# EAGLE design dice2_perf (EAGLE 9.0.1)

## Sheet 1 of 2
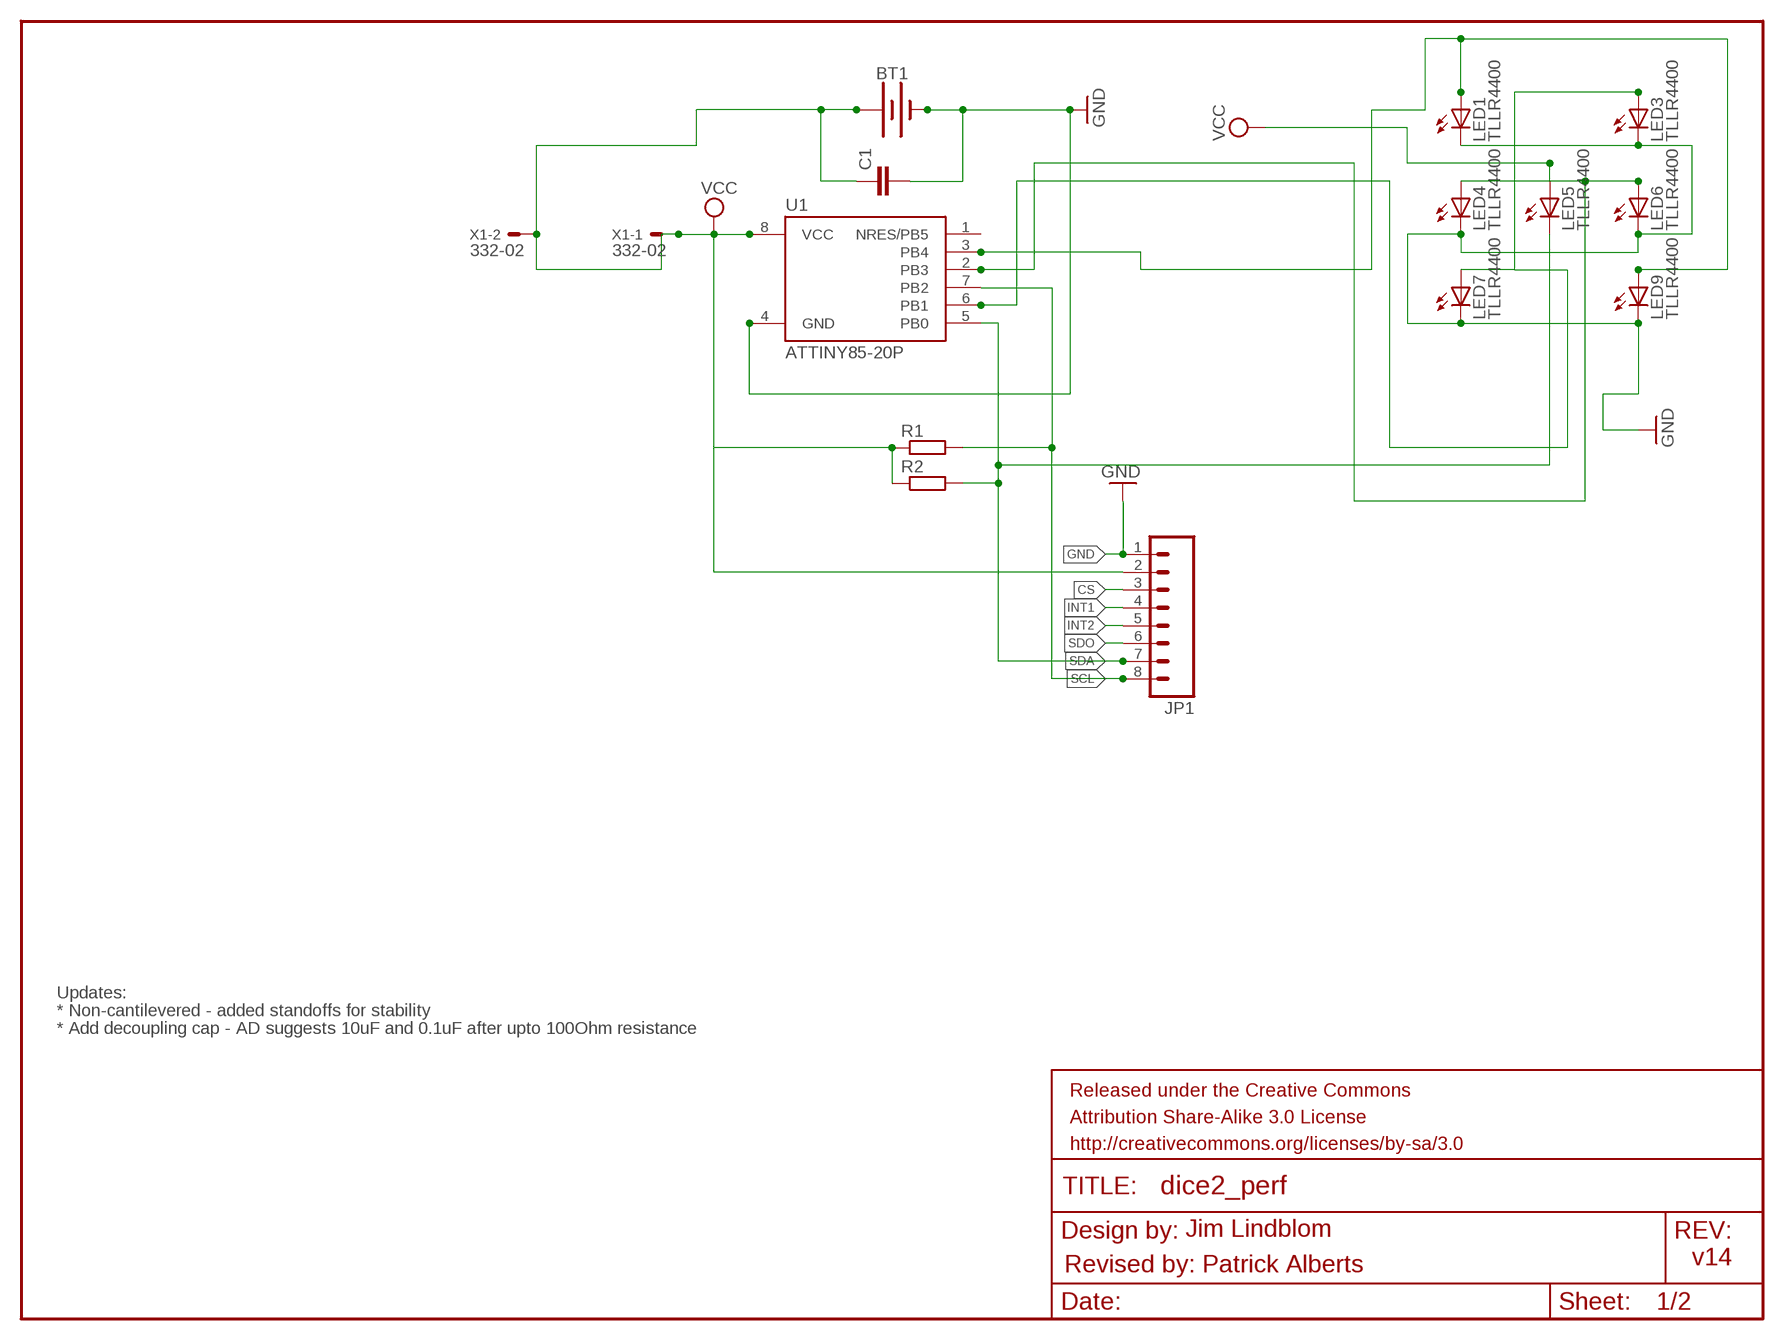
[diagram p0: schematic, sheet 1]

### Parts
BT1  BATTERY-20MM_PTH  [BATTCOM_20MM_PTH]
C1  C-EU025-024X044  [C025-024X044]
JP1  M08  [1X08]
LED1  TLLR4400  [LED3MM]
LED3  TLLR4400  [LED3MM]
LED4  TLLR4400  [LED3MM]
LED5  TLLR4400  [LED3MM]
LED6  TLLR4400  [LED3MM]
LED7  TLLR4400  [LED3MM]
LED9  TLLR4400  [LED3MM]
R1  R-EU_0207/12  [0207/12]
R2  R-EU_0207/2V  [0207/2V]
U1  ATTINY85-20P  [PDIP08_300MIL]
X1  332-02  [332-02]

### Nets
CS: JP1.3
GND: BT1.2(-) C1.2 JP1.1 LED1.K(C) LED3.K(C) LED4.K(C) LED6.K(C) LED7.K(C) LED9.K(C) U1.4(GND)
INT1: JP1.4
INT2: JP1.5
N$2: LED1.A LED9.A U1.3(PB4)
N$5: LED4.A LED6.A U1.2(PB3)
N$7: LED3.A LED7.A U1.6(PB1)
SCL: JP1.8 R1.2 U1.7(PB2)
SDA: JP1.7 LED5.K(C) R2.2 U1.5(PB0)
SDO: JP1.6
VCC: BT1.1(+) C1.1 JP1.2 LED5.A R1.1 R2.1 U1.8(VCC) X1.1 X1.2
Unconnected: U1.1(NRES/PB5)

### Notes on the sheet
- Updates:
- * Non-cantilevered - added standoffs for stability
- * Add decoupling cap - AD suggests 10uF and 0.1uF after upto 100Ohm resistance
- Jim Lindblom
- v14
- Revised by: Patrick Alberts

## Sheet 2 of 2

## Library data of the parts
BT1 = SparkFun-Batteries:BATTERY: Battery - Single Cell A variety of battery chemistries, sizes, and footprints. Device List: 20MM_PTH - Coin Cell Battery Holder - 20mm (PTH) <https://www.sparkfun.com/products/783> 6.8MM_PTH - Coin Cell Battery Holder - 6.8MM(SMD) <https://www.digikey.com/product-detail/en/seiko-instruments/MS621FE-FL11E/728-1057-ND/1889208?WT.srch=1&gclid=CNOQ5a6LzdQCFZS2wAodXCkE0g> 12MM_SMD - Coin Cell Battery Holder - 12mm (SMD) <https://www.sparkfun.com/products/10592> 12MM_PTH - Coin Cell Battery Holder - 12mm (PTH) <https://www.sparkfun.com/products/7948> 20MM_SMD - 20mm Coin Cell Battery Holder (SMD) (2 legs) Used on the Big Time Watch Kit <https://www.sparkfun.com/products/11734> 20MM_SMD_4LEGS - Coin Cell Battery Holder - 20mm (SMD) <https://www.sparkfun.com/products/11892> 20MM_SMD_4LEGS_OVERPASTE - Coin Cell Battery Holder - 20mm (SMD) <https://www.sparkfun.com/products/11892> (Over-paste on the legs) 24.5MM_PTH - Coin Cell Battery Holder - 24.5mm (PTH) <https://www.sparkfun.com/products/8863> 9V - 9V Battery Holder - PC Mount Used on the SparkFun SparkPunk Sound Kit <https://www.sparkfun.com/products/11177> and SparkFun SparkPunk Sequencer Kit <https://www.sparkfun.com/products/12707> 18650 - Battery Holder - 18650 (PTH) <https://www.sparkfun.com/products/13113> AA - Battery Holder - 1xAA (PTH) <https://www.sparkfun.com/products/7949> AAA - Battery Holder - 1xAAA (PTH) <https://www.sparkfun.com/products/12718> AA_KIT - Battery Holder - 1xAA (PTH) <https://www.sparkfun.com/products/7949> Special kit package - pads only have exposed copper on one side of the board. AAA_KIT - Battery Holder - 1xAAA (PTH) <https://www.sparkfun.com/products/12718> Special kit package - pads only have exposed copper on one side of the board.; PROD_ID: BATT-09031; SF_SKU: PRT-00783
C1 = resistor:C-EU: CAPACITOR, European symbol
JP1 = SparkFun:M08: Header 8 Standard 8-pin 0.1" header. Use with straight break away headers (SKU : PRT-00116), right angle break away headers (PRT-00553), swiss pins (PRT-00743), machine pins (PRT-00117), and female headers (PRT-00115).
LED1 LED3-LED7 LED9 = led:TLLR4400: Low Current (2mA) LED 3 mm Tinted Diffused Package color RED Source: Data sheet <http://www.farnell.com/datasheets/391100.pdf>; MF: VISHAY SEMICONDUCTOR; OC_FARNELL: 1612437
R1 R2 = resistor:R-EU_: RESISTOR, European symbol
U1 = _hhn_attiny25_45_85:ATTINY85*: ATMEL ATtiny 85 Packages: P = PDIP 08 30mil S = SOIC 08 EIAJ 208mil Technologies Note: for complete ordering code (temp. range, finish, tape&reel etc.) see www.atmel.com • Supply Voltage: V = (1.8…5.5)V | [blank] = (2.7…5.5)V • Speed: 10 = 10 MHz | 20 = 20 MHz Author: Dipl.-Ing. FH Rainer Bayer HHN Hochschule Heilbronn (Heilbronn University), rainer.bayer@hs-heilbronn.de Ingenieurbüro ing-rb, mail@ing-rb.de
X1 = con-garry:332-02: 2 Pin - 2mm Dual Row Source: www.mpe-connector.de / garry_shortform_2012.pdf

## Board
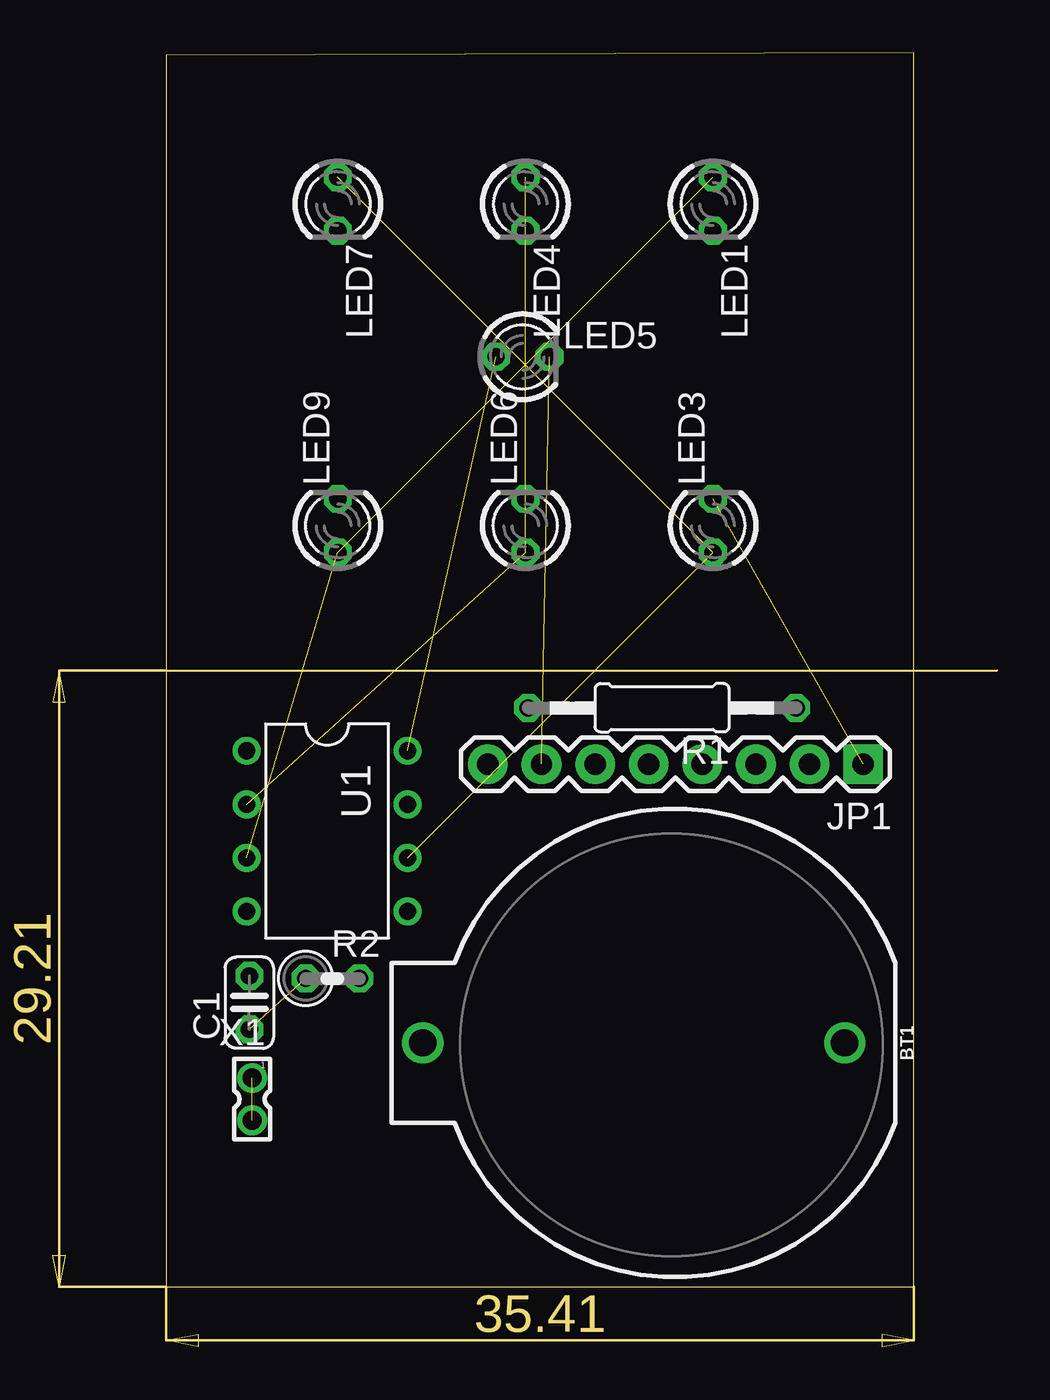
[diagram p1: board, top side]
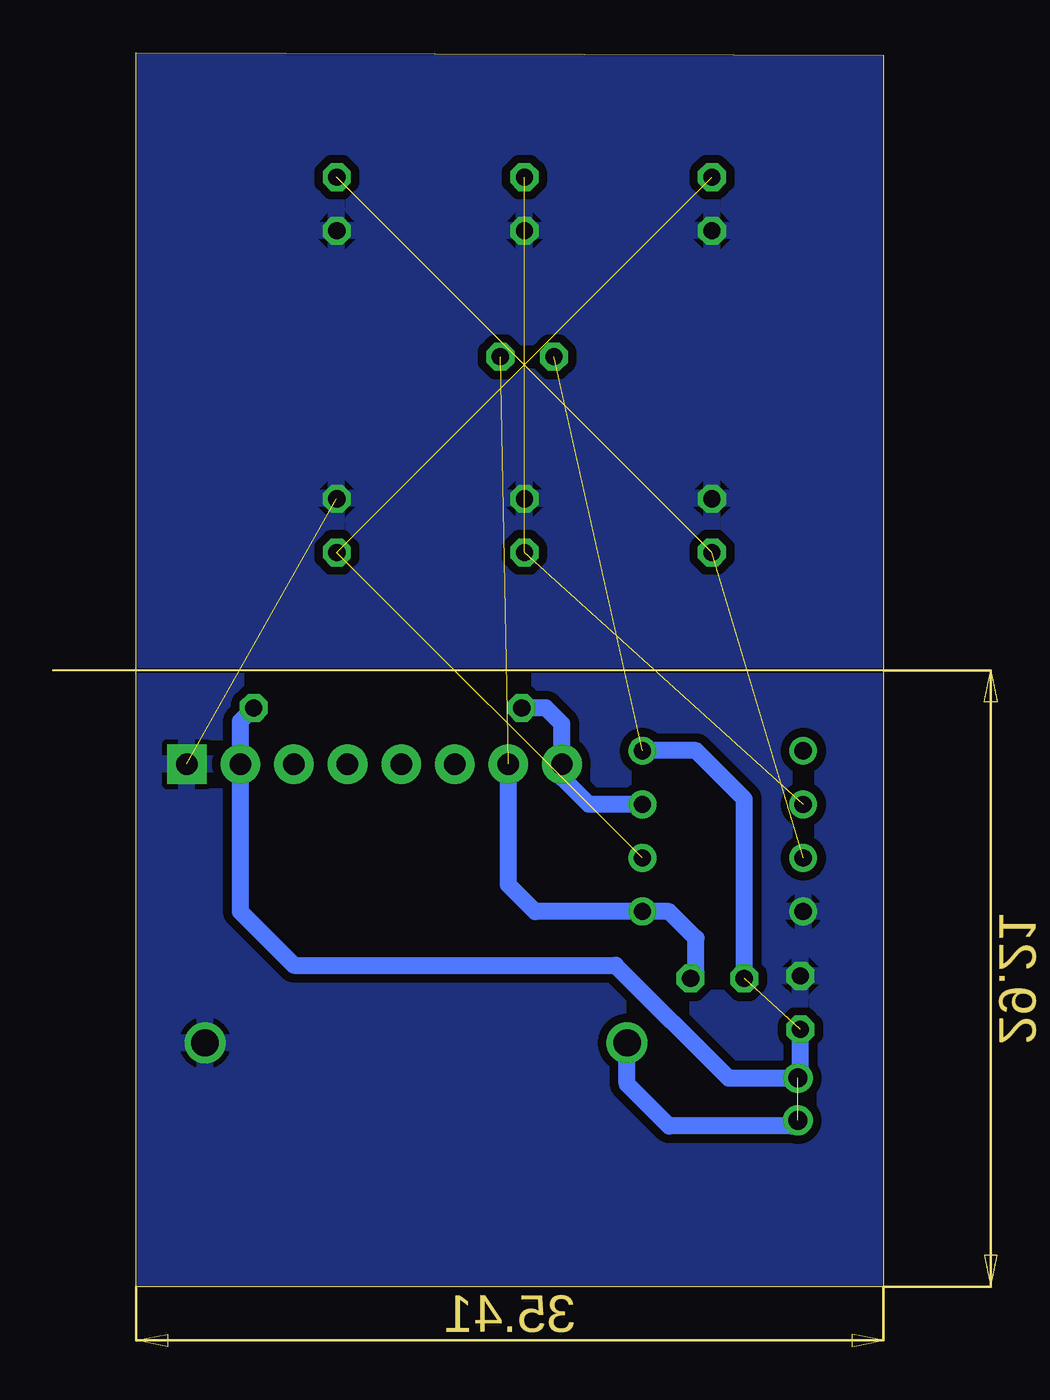
[diagram p2: board, bottom side, seen from below]

Size 39.37 x 58.47 mm. Coordinates in mm from the lower left corner, seen from the top.
Outline: 0,29.21 0,58.34 35.41,58.47 35.41,0 0,0 0,29.21
Outline: 0,29.21 39.37,29.21
Copper layers (1*16): Top 0.035mm / dielectric 1.5mm / Bottom 0.035mm
Design rules "default *": minimum track width 6mil, minimum drill 0.35mm, track to track 16mil, track to pad 6mil, pad to pad 6mil, via to via 6mil, smd to smd 6mil, copper to edge 2mil, drill to drill 6mil, minimum pad ring 10mil, minimum via ring 8mil, stop-mask expansion 4mil, vias tented up to drill 0mil, thermal gap 10mil

### Footprints (pad centres in the part's own frame; a part is rotated, then mirrored left to right if it is on the bottom)
BATTCOM_20MM_PTH = drill 1.3: 1 11.85,0; 2 -8.15,0
C025-024X044 = drill 0.813 octagon: 1 -1.27,0; 2 1.27,0
1X08 = drill 1.016 pad 1.88 square: 1 0,0 | drill 1.016 pad 1.88: 2 2.54,0; 3 5.08,0; 4 7.62,0; 5 10.16,0; 6 12.7,0; 7 15.24,0; 8 17.78,0
LED3MM = drill 0.813 octagon: A -1.27,0; K 1.27,0
0207/12 = drill 0.813 octagon: 1 -6.35,0; 2 6.35,0
0207/2V = drill 0.813 octagon: 1 -1.27,0; 2 1.27,0
PDIP08_300MIL = drill 0.813: 1 -3.81,-3.81; 2 -1.27,-3.81; 3 1.27,-3.81; 4 3.81,-3.81; 5 3.81,3.81; 6 1.27,3.81; 7 -1.27,3.81; 8 -3.81,3.81
332-02 = drill 0.9 pad 1.27: 1 0,-1; 2 0,1

### Placement (x,y rotation side)
BT1  24,11.56 180 top
C1  3.94,13.46 90 top
JP1  33.02,24.77 180 top
LED1  25.91,51.31 270 top
LED3  25.91,36.07 90 top
LED4  17.02,51.31 270 top
LED5  16.89,44.07 0 top
LED6  17.02,36.07 90 top
LED7  8.13,51.31 270 top
LED9  8.13,36.07 90 top
R1  23.5,27.43 180 top
R2  7.87,14.61 0 top
U1  7.62,21.59 270 top
X1  4.06,8.89 180 top

### Tracks (layer width: path | path; a pad name or v marks a point on that pad's centre or on a via)
GND  (1 unrouted)
  pour Bottom: 0,0 0,29.21 35.18,29.21 35.18,0
  pour Bottom: 0,29.21 0,58.42 35.05,58.42 35.05,29.21
N$2  (2 unrouted)
N$5  (2 unrouted)
N$7  (2 unrouted)
SCL
  Bottom 0.813: U1.7 13.97,22.86 15.24,24.13 JP1.8 15.24,26.67 16,27.43 R1.2
SDA  (1 unrouted)
  Bottom 0.813: JP1.7 17.78,19.05 16.51,17.78 U1.5 10.16,17.78 8.89,16.51 8.89,14.86 R2.2
VCC  (3 unrouted)
  Bottom 0.813: R2.1 6.6,23.11 8.89,25.4 U1.8 | R1.1 30.48,26.8 JP1.2 30.48,17.78 27.94,15.24 12.7,15.24 7.35,9.89 X1.1 3.94,10.02 C1.1 | X1.2 4.33,7.62 10.16,7.62 12.15,9.61 BT1.1